# EAGLE design Shift-Rgisters (EAGLE 9.6.2)
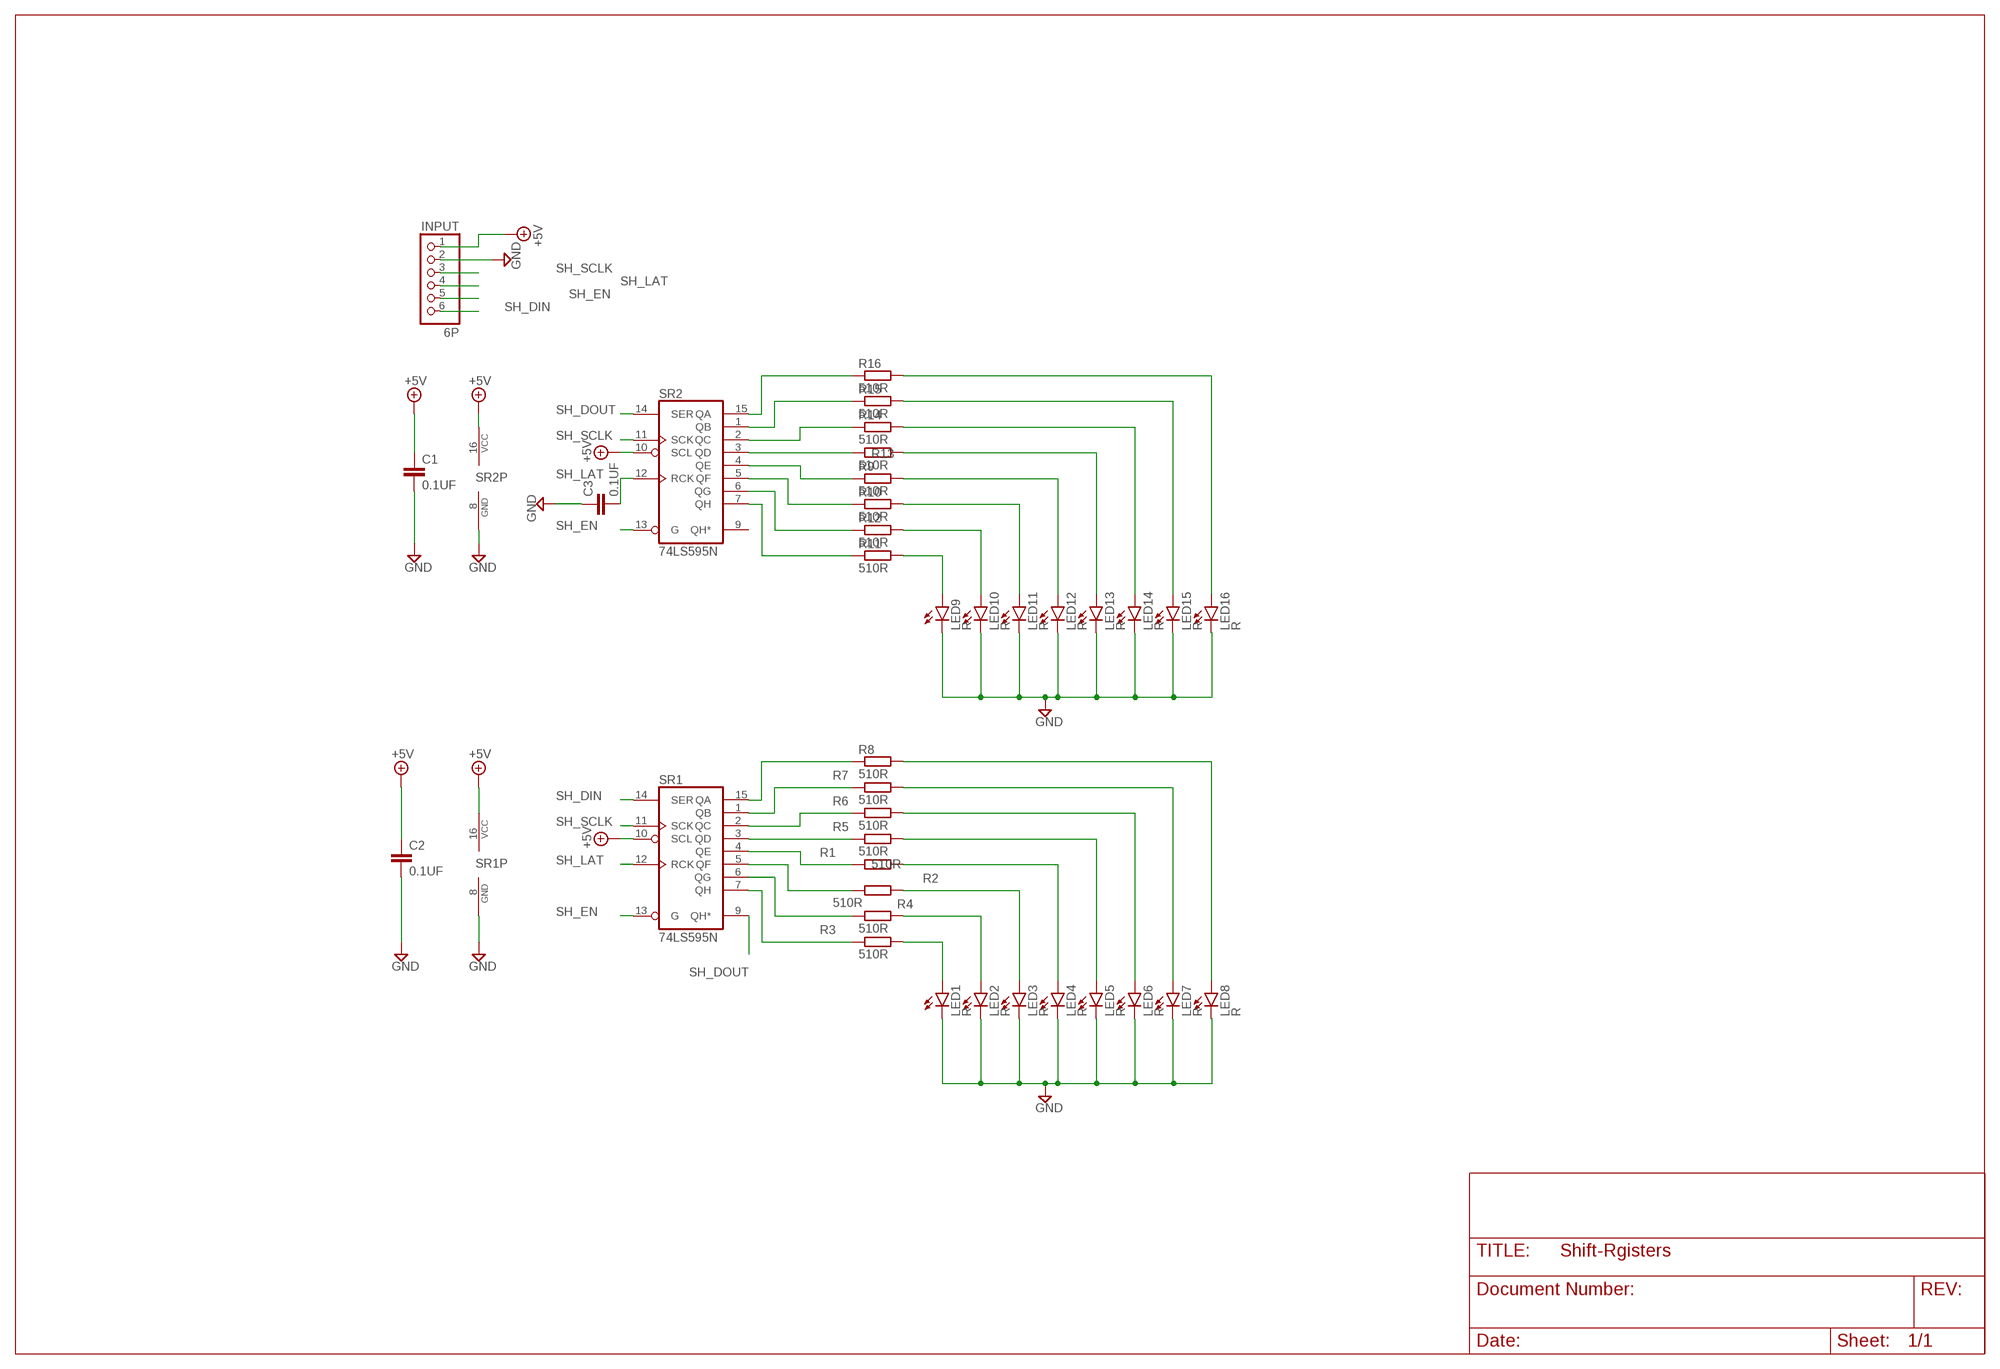
[diagram p0: schematic, sheet 1]

## Parts
C1  0.1UF  C-EU050-030X075  [C050-030X075]
C2  0.1UF  C-EU050-030X075  [C050-030X075]
C3  0.1UF  C-EU050-030X075  [C050-030X075]
INPUT  6P  PINHD-1X6  [1X06]
LED1  R  LED5MM  [LED5MM]
LED2  R  LED5MM  [LED5MM]
LED3  R  LED5MM  [LED5MM]
LED4  R  LED5MM  [LED5MM]
LED5  R  LED5MM  [LED5MM]
LED6  R  LED5MM  [LED5MM]
LED7  R  LED5MM  [LED5MM]
LED8  R  LED5MM  [LED5MM]
LED9  R  LED5MM  [LED5MM]
LED10  R  LED5MM  [LED5MM]
LED11  R  LED5MM  [LED5MM]
LED12  R  LED5MM  [LED5MM]
LED13  R  LED5MM  [LED5MM]
LED14  R  LED5MM  [LED5MM]
LED15  R  LED5MM  [LED5MM]
LED16  R  LED5MM  [LED5MM]
R1  510R  R-EU_0207/10  [0207/10]
R2  510R  R-EU_0207/10  [0207/10]
R3  510R  R-EU_0207/10  [0207/10]
R4  510R  R-EU_0207/10  [0207/10]
R5  510R  R-EU_0207/10  [0207/10]
R6  510R  R-EU_0207/10  [0207/10]
R7  510R  R-EU_0207/10  [0207/10]
R8  510R  R-EU_0207/10  [0207/10]
R9  510R  R-EU_0207/10  [0207/10]
R10  510R  R-EU_0207/10  [0207/10]
R11  510R  R-EU_0207/10  [0207/10]
R12  510R  R-EU_0207/10  [0207/10]
R13  510R  R-EU_0207/10  [0207/10]
R14  510R  R-EU_0207/10  [0207/10]
R15  510R  R-EU_0207/10  [0207/10]
R16  510R  R-EU_0207/10  [0207/10]
SR1  74LS595N  [DIL16]
SR2  74LS595N  [DIL16]

## Nets
+5V [POWER]: C1.1 C2.1 INPUT.1 SR1.10(SCL) SR1.16(VCC) SR2.10(SCL) SR2.16(VCC)
GND [POWER]: C1.2 C2.2 C3.1 INPUT.2 LED1.K(C) LED2.K(C) LED3.K(C) LED4.K(C) LED5.K(C) LED6.K(C) LED7.K(C) LED8.K(C) LED9.K(C) LED10.K(C) LED11.K(C) LED12.K(C) LED13.K(C) LED14.K(C) LED15.K(C) LED16.K(C) SR1.8(GND) SR2.8(GND)
N$1: R8.1 SR1.15(QA)
N$2: R7.1 SR1.1(QB)
N$3: R6.1 SR1.2(QC)
N$4: R5.1 SR1.3(QD)
N$5: R1.1 SR1.4(QE)
N$6: R2.1 SR1.5(QF)
N$7: R4.1 SR1.6(QG)
N$8: R3.1 SR1.7(QH)
N$9: LED1.A R3.2
N$10: LED2.A R4.2
N$11: LED3.A R2.2
N$12: LED4.A R1.2
N$13: LED5.A R5.2
N$14: LED6.A R6.2
N$15: LED7.A R7.2
N$16: LED8.A R8.2
N$17: R16.1 SR2.15(QA)
N$18: R15.1 SR2.1(QB)
N$19: R14.1 SR2.2(QC)
N$20: R13.1 SR2.3(QD)
N$21: R9.1 SR2.4(QE)
N$22: R10.1 SR2.5(QF)
N$23: R12.1 SR2.6(QG)
N$24: R11.1 SR2.7(QH)
N$25: LED9.A R11.2
N$26: LED10.A R12.2
N$27: LED11.A R10.2
N$28: LED12.A R9.2
N$29: LED13.A R13.2
N$30: LED14.A R14.2
N$31: LED15.A R15.2
N$32: LED16.A R16.2
SH_DIN: INPUT.6 SR1.14(SER)
SH_DOUT: SR1.9(QH*) SR2.14(SER)
SH_EN: INPUT.5 SR1.13(G) SR2.13(G)
SH_LAT: C3.2 INPUT.4 SR1.12(RCK) SR2.12(RCK)
SH_SCLK: INPUT.3 SR1.11(SCK) SR2.11(SCK)
Unconnected: SR2.9(QH*)

## Library data of the parts
C1-C3 = rcl:C-EU: CAPACITOR, European symbol; SPICEPREFIX: C
INPUT = pinhead:PINHD-1X6: PIN HEADER
LED1-LED16 = led:LED: LED OSRAM: - CHIPLED LG R971, LG N971, LY N971, LG Q971, LY Q971, LO R971, LY R971 LH N974, LH R974 LS Q976, LO Q976, LY Q976 LO Q996 - Hyper CHIPLED LW Q18S LB Q993, LB Q99A, LB R99A - SideLED LS A670, LO A670, LY A670, LG A670, LP A670 LB A673, LV A673, LT A673, LW A673 LH A674 LY A675 LS A676, LA A676, LO A676, LY A676, LW A676 LS A679, LY A679, LG A679 - Hyper Micro SIDELED® LS Y876, LA Y876, LO Y876, LY Y876 LT Y87S - SmartLED LW L88C, LW L88S LB L89C, LB L89S, LG L890 LS L89K, LO L89K, LY L89K LS L896, LA L896, LO L896, LY L896 - TOPLED LS T670, LO T670, LY T670, LG T670, LP T670 LSG T670, LSP T670, LSY T670, LOP T670, LYG T670 LG T671, LOG T671, LSG T671 LB T673, LV T673, LT T673, LW T673 LH T674 LS T676, LA T676, LO T676, LY T676, LB T676, LH T676, LSB T676, LW T676 LB T67C, LV T67C, LT T67C, LS T67K, LO T67K, LY T67K, LW E67C LS E67B, LA E67B, LO E67B, LY E67B, LB E67C, LV E67C, LT E67C LW T67C LS T679, LY T679, LG T679 LS T770, LO T770, LY T770, LG T770, LP T770 LB T773, LV T773, LT T773, LW T773 LH T774 LS E675, LA E675, LY E675, LS T675 LS T776, LA T776, LO T776, LY T776, LB T776 LHGB T686 LT T68C, LB T68C - Hyper Mini TOPLED® LB M676 - Mini TOPLED Santana® LG M470 LS M47K, LO M47K, LY M47K Source: http://www.osram.convergy.de LUXEON: - LUMILED® LXK2-PW12-R00, LXK2-PW12-S00, LXK2-PW14-U00, LXK2-PW14-V00 LXK2-PM12-R00, LXK2-PM12-S00, LXK2-PM14-U00 LXK2-PE12-Q00, LXK2-PE12-R00, LXK2-PE12-S00, LXK2-PE14-T00, LXK2-PE14-U00 LXK2-PB12-K00, LXK2-PB12-L00, LXK2-PB12-M00, LXK2-PB14-N00, LXK2-PB14-P00, LXK2-PB14-Q00 LXK2-PR12-L00, LXK2-PR12-M00, LXK2-PR14-Q00, LXK2-PR14-R00 LXK2-PD12-Q00, LXK2-PD12-R00, LXK2-PD12-S00 LXK2-PH12-R00, LXK2-PH12-S00 LXK2-PL12-P00, LXK2-PL12-Q00, LXK2-PL12-R00 Source: www.luxeon.com KINGBRIGHT: KA-3528ASYC Source: www.kingbright.com
R1-R16 = rcl:R-EU_: RESISTOR, European symbol; SPICEPREFIX: R
SR1 SR2 = 74xx-us:74*595: 8-bit SHIFT REGISTER, output latch

## Net classes
0 default: width 0.254 mm, drill 0.406 mm, clearance 0.305 mm
1 POWER: width 0.406 mm, drill 0.406 mm, clearance 0.305 mm

## Board
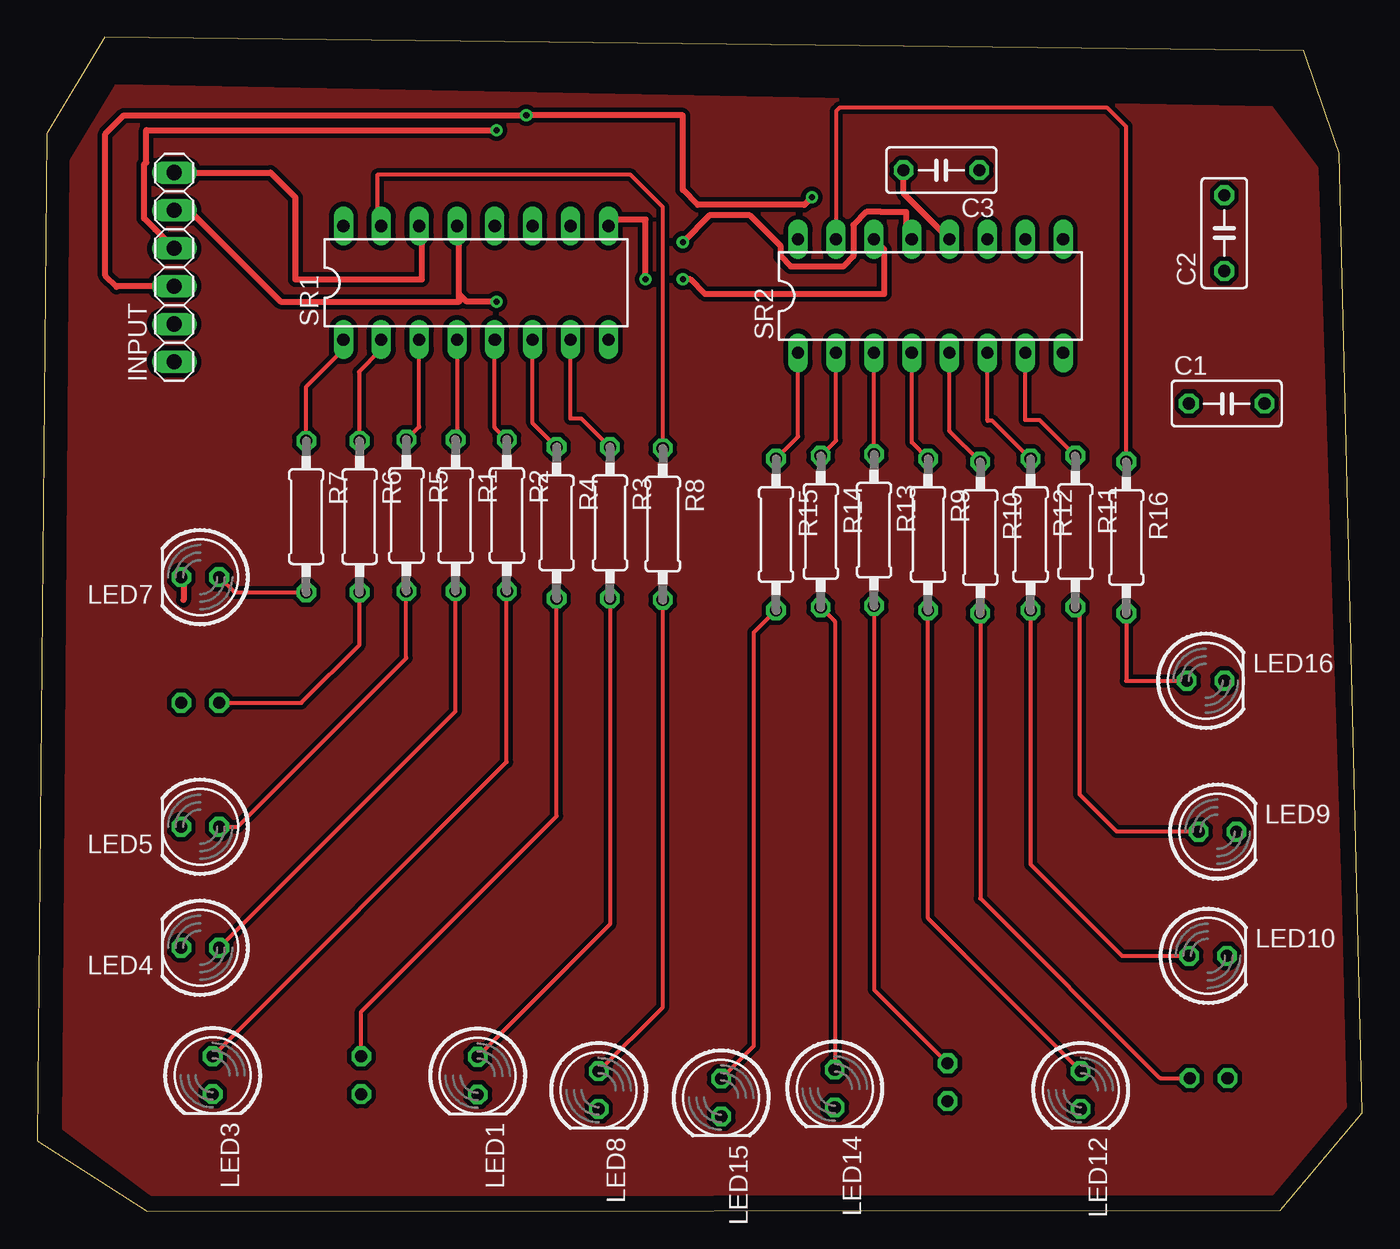
[diagram p1: board, top side]
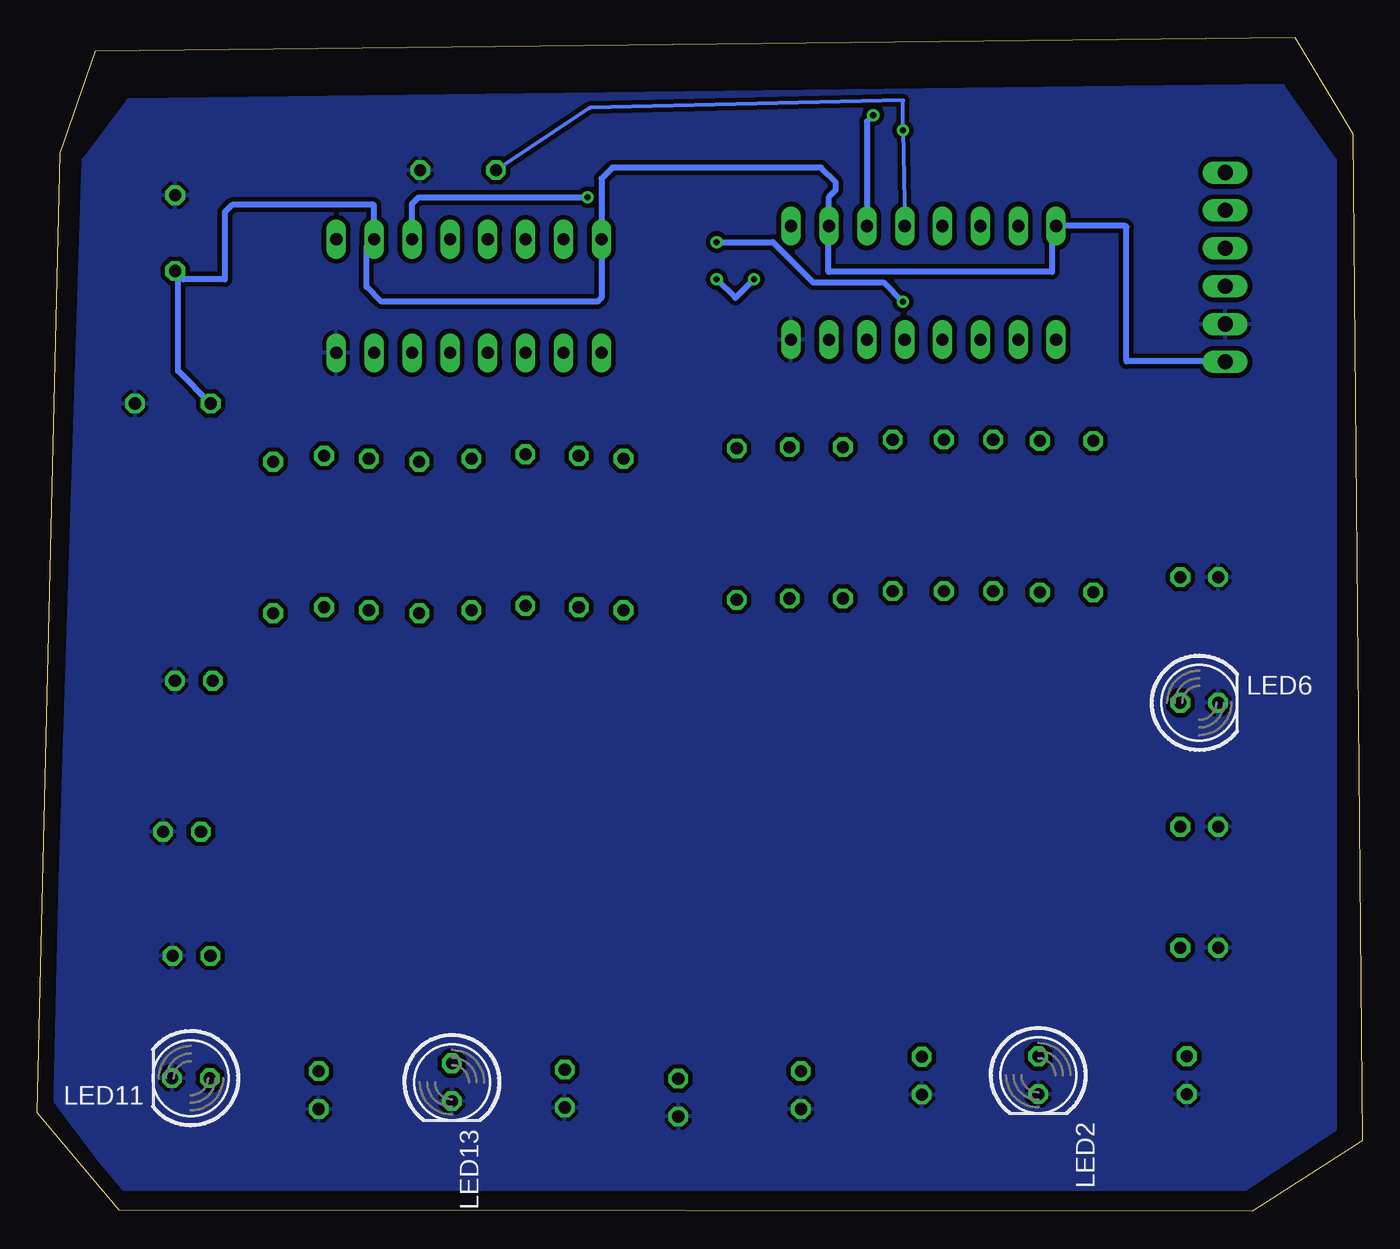
[diagram p2: board, bottom side, seen from below]

Size 88.9 x 78.76 mm. Coordinates in mm from the lower left corner, seen from the top.
Outline: 0.64,72.29 0,4.75 7.37,0 83.39,0.09 88.9,6.61 87.36,70.97 84.98,77.85 4.53,78.76 0.64,72.29
Copper layers (1*16): Top 0.035mm / dielectric 1.5mm / Bottom 0.035mm
Design rules "default": minimum track width 6mil, minimum drill 0.35mm, track to track 6mil, track to pad 6mil, pad to pad 6mil, via to via 6mil, smd to smd 6mil, copper to edge 40mil, drill to drill 6mil, minimum pad ring 10mil, minimum via ring 8mil, stop-mask expansion 4mil, vias tented up to drill 0mil, thermal gap 10mil

### Footprints (pad centres in the part's own frame; a part is rotated, then mirrored left to right if it is on the bottom)
C050-030X075 = drill 0.813 octagon: 1 -2.54,0; 2 2.54,0
1X06 = drill 1.016 long: 1 -6.35,0; 2 -3.81,0; 3 -1.27,0; 4 1.27,0; 5 3.81,0; 6 6.35,0
LED5MM = drill 0.813 octagon: A -1.27,0; K 1.27,0
0207/10 = drill 0.813 octagon: 1 -5.08,0; 2 5.08,0
DIL16 = drill 0.813 long: 1 -8.89,-3.81; 2 -6.35,-3.81; 3 -3.81,-3.81; 4 -1.27,-3.81; 5 1.27,-3.81; 6 3.81,-3.81; 7 6.35,-3.81; 8 8.89,-3.81; 9 8.89,3.81; 10 6.35,3.81; 11 3.81,3.81; 12 1.27,3.81; 13 -1.27,3.81; 14 -3.81,3.81; 15 -6.35,3.81; 16 -8.89,3.81

### Placement (x,y rotation side)
C1  79.8,54.19 0 top
C2  79.64,65.62 90 top
C3  60.67,69.85 180 top
INPUT  9.2,63.33 90 top
LED1  29.55,9.11 270 top
LED2  21.74,9.14 270 bottom
LED3  11.77,9.14 270 top
LED4  10.94,17.69 180 top
LED5  10.94,25.81 180 top
LED6  10.94,34.12 0 bottom
LED7  10.94,42.55 180 top
LED8  37.67,8.14 270 top
LED9  79.19,25.48 0 top
LED10  78.55,17.15 0 top
LED11  78.59,8.95 180 bottom
LED12  70.01,8.14 270 top
LED13  61.08,8.67 270 bottom
LED14  53.51,8.24 270 top
LED15  45.89,7.64 270 top
LED16  78.39,35.6 0 top
R1  28.06,46.69 270 top
R2  31.5,46.69 270 top
R3  38.42,46.19 270 top
R4  34.84,46.19 270 top
R5  24.76,46.69 270 top
R6  21.63,46.6 270 top
R7  18.05,46.6 270 top
R8  41.97,46.1 270 top
R9  59.77,45.4 270 top
R10  63.27,45.2 270 top
R11  69.65,45.6 270 top
R12  66.65,45.4 270 top
R13  56.15,45.7 270 top
R14  52.57,45.6 270 top
R15  49.57,45.4 270 top
R16  73.07,45.2 270 top
SR1  29.43,62.29 0 top
SR2  59.94,61.4 0 top

### Tracks (layer width: path | path; a pad name or v marks a point on that pad's centre or on a via)
+5V
  Bottom 0.406: INPUT.1 9.23,57.02 15.81,57.02 15.81,66.02 15.89,66.1 SR1.16 20.81,65.83 20.81,63.02 35.81,63.02 35.81,66.07 SR1.10 35.78,68.06 35.31,68.52 35.31,69.02 36.31,70.02 50.31,70.02 51.05,69.28 SR2.16 51.05,61.28 51.31,61.02 65.81,61.02 66.81,62.02 66.81,64.69 SR2.10 66.31,65.23 66.31,67.52 75.81,67.52 76.31,67.02 76.31,62.52 79.08,62.52 79.45,62.89 | 79.45,62.89 C2.1 | C1.1 79.45,56.38 79.45,62.89
GND
  Top 0.406: LED7.K 9.81,42.4 9.81,41.02
  pour Bottom (isolate 0.254): 5.31,75.52 82.81,74.52 85.81,70.52 87.81,7.52 83.31,1.52 7.81,1.52 1.81,5.52 1.81,70.52
GND2
  pour Top (isolate 0.254): 5.31,75.52 82.81,74.02 85.81,70.02 87.81,7.02 82.81,1.02 7.81,1.02 1.81,5.52 2.31,70.52
N$1
  Top 0.254: R8.1 41.97,67.37 39.81,69.52 22.81,69.52 22.81,66.37 SR1.15
N$2
  Top 0.254: R7.1 18.05,55.33 20.54,57.82 SR1.1
N$3
  Top 0.254: R6.1 21.58,51.73 21.58,56.32 23.08,57.82 SR1.2
N$4
  Top 0.254: R5.1 25.62,52.63 SR1.3
N$5
  Top 0.254: SR1.4 28.16,51.87 R1.1
N$6
  Top 0.254: R2.1 30.7,52.58 SR1.5
N$7
  Top 0.254: R4.1 33.24,52.88 SR1.6
N$8
  Top 0.254: R3.1 36.52,53.18 35.78,53.18 SR1.7
N$9
  Top 0.254: R3.2 38.42,19.25 LED1.A
N$10
  Top 0.254: LED2.A 21.74,13.41 34.84,26.52 R4.2
N$11
  Top 0.254: LED3.A 31.5,30.15 R2.2
N$12
  Top 0.254: LED4.A 28.06,33.54 R1.2
N$13
  Top 0.254: LED5.A 13.46,25.81 24.76,37.11 R5.2
N$14
  Top 0.254: LED6.A 17.72,34.12 21.63,38.02 R6.2
N$15
  Top 0.254: LED7.A 13.23,41.52 R7.2
N$16
  Top 0.254: LED8.A 41.97,13.71 R8.2
N$17
  Top 0.254: R16.1 73.07,72.77 71.81,74.02 53.81,74.02 53.59,73.8 SR2.15
N$18
  Top 0.254: R15.1 51.05,51.97 SR2.1
N$19
  Top 0.254: R14.1 53.59,51.71 SR2.2
N$20
  Top 0.254: R13.1 56.13,50.8 SR2.3
N$21
  Top 0.254: R9.1 58.67,51.58 SR2.4
N$22
  Top 0.254: R10.1 61.21,52.34 SR2.5
N$23
  Top 0.254: R12.1 64.1,53.03 63.75,53.03 SR2.6
N$24
  Top 0.254: R11.1 67.26,53.07 66.29,53.07 SR2.7
N$25
  Top 0.254: LED9.A 72.42,25.48 69.92,27.98 69.92,40.25 R11.2
N$26
  Top 0.254: R12.2 66.65,23.28 72.78,17.15 LED10.A
N$27
  Top 0.254: R10.2 63.27,21 75.32,8.95 LED11.A
N$28
  Top 0.254: LED12.A 59.77,19.65 R9.2
N$29
  Top 0.254: R13.2 56.15,14.87 LED13.A
N$30
  Top 0.254: R14.2 53.51,39.58 LED14.A
N$31
  Top 0.254: LED15.A 48.07,11.09 48.07,38.82 R15.2
N$32
  Top 0.254: R16.2 73.07,35.6 LED16.A
SH_DIN
  Top 0.406: INPUT.6 15.65,69.68 17.31,68.02 17.31,62.52 25.81,62.52 25.81,65.91 SR1.14
SH_DOUT  (via drill 0.41)
  Top 0.406: SR2.14 56.81,64.53 56.81,61.52 44.81,61.52 43.81,62.52 v43.31,62.52 | v40.81,62.52 40.81,66.52 38.74,66.52 SR1.9
  Bottom 0.406: v43.31,62.52 42.06,61.27 v40.81,62.52
SH_EN  (via drill 0.41)
  Top 0.406: INPUT.5 10.19,67.14 16.31,61.02 28.31,61.02 28.31,61.52 | 28.31,61.52 28.31,65.95 SR1.13 | SR2.13 58.31,65.57 58.31,67.02 56.64,67.02 56.62,67.04 55.65,67.04 54.76,66.15 54.76,64.07 54.08,63.38 50.57,63.38 49.88,64.07 49.88,64.74 47.81,66.81 45.1,66.81 v43.31,65.02 | v30.81,61.02 28.81,61.02 28.31,61.52
  Bottom 0.406: v30.81,61.02 32.1,62.31 36.84,62.31 39.55,65.02 v43.31,65.02
SH_LAT  (via drill 0.41)
  Top 0.406: INPUT.4 7.93,65.87 7.91,65.87 7.16,66.62 7.16,70.21 7.31,70.36 7.31,72.52 v30.81,72.52 | SR2.12 58.13,68.3 C3.2
  Bottom 0.254: C3.2 51.81,74.02 30.81,74.52 v30.81,72.52 SR1.12
SH_SCLK  (via drill 0.41)
  Top 0.406: INPUT.3 5.36,62.06 5.31,62.02 4.56,62.77 4.56,72.27 5.81,73.52 v32.81,73.52 43.31,73.52 43.31,68.52 44.31,67.52 51.47,67.52 v51.97,68.02
  Bottom 0.406: v32.81,73.52 33.24,73.1 SR1.11 | SR2.11 63.75,67.58 63.31,68.02 v51.97,68.02